# Altium schematic sheet Schema chargeur USB projet robot.SchDoc
size A4; PageSetup: Record=PageOptions|CenterHorizontal=True|CenterVertical=True|PrintScale=1.42|XCorrection=1.00|YCorrection=1.00|PrintKind=0|BorderSize=5000000|LeftOffset=0|BottomOffset=0|Orientation=2|PaperLength=1000|PaperWidth=1000|Scale=100|PaperSource=7|PrintQuality=-4|MediaType=1|DitherType=10|PaperKind=A3|PrintScaleMode=1
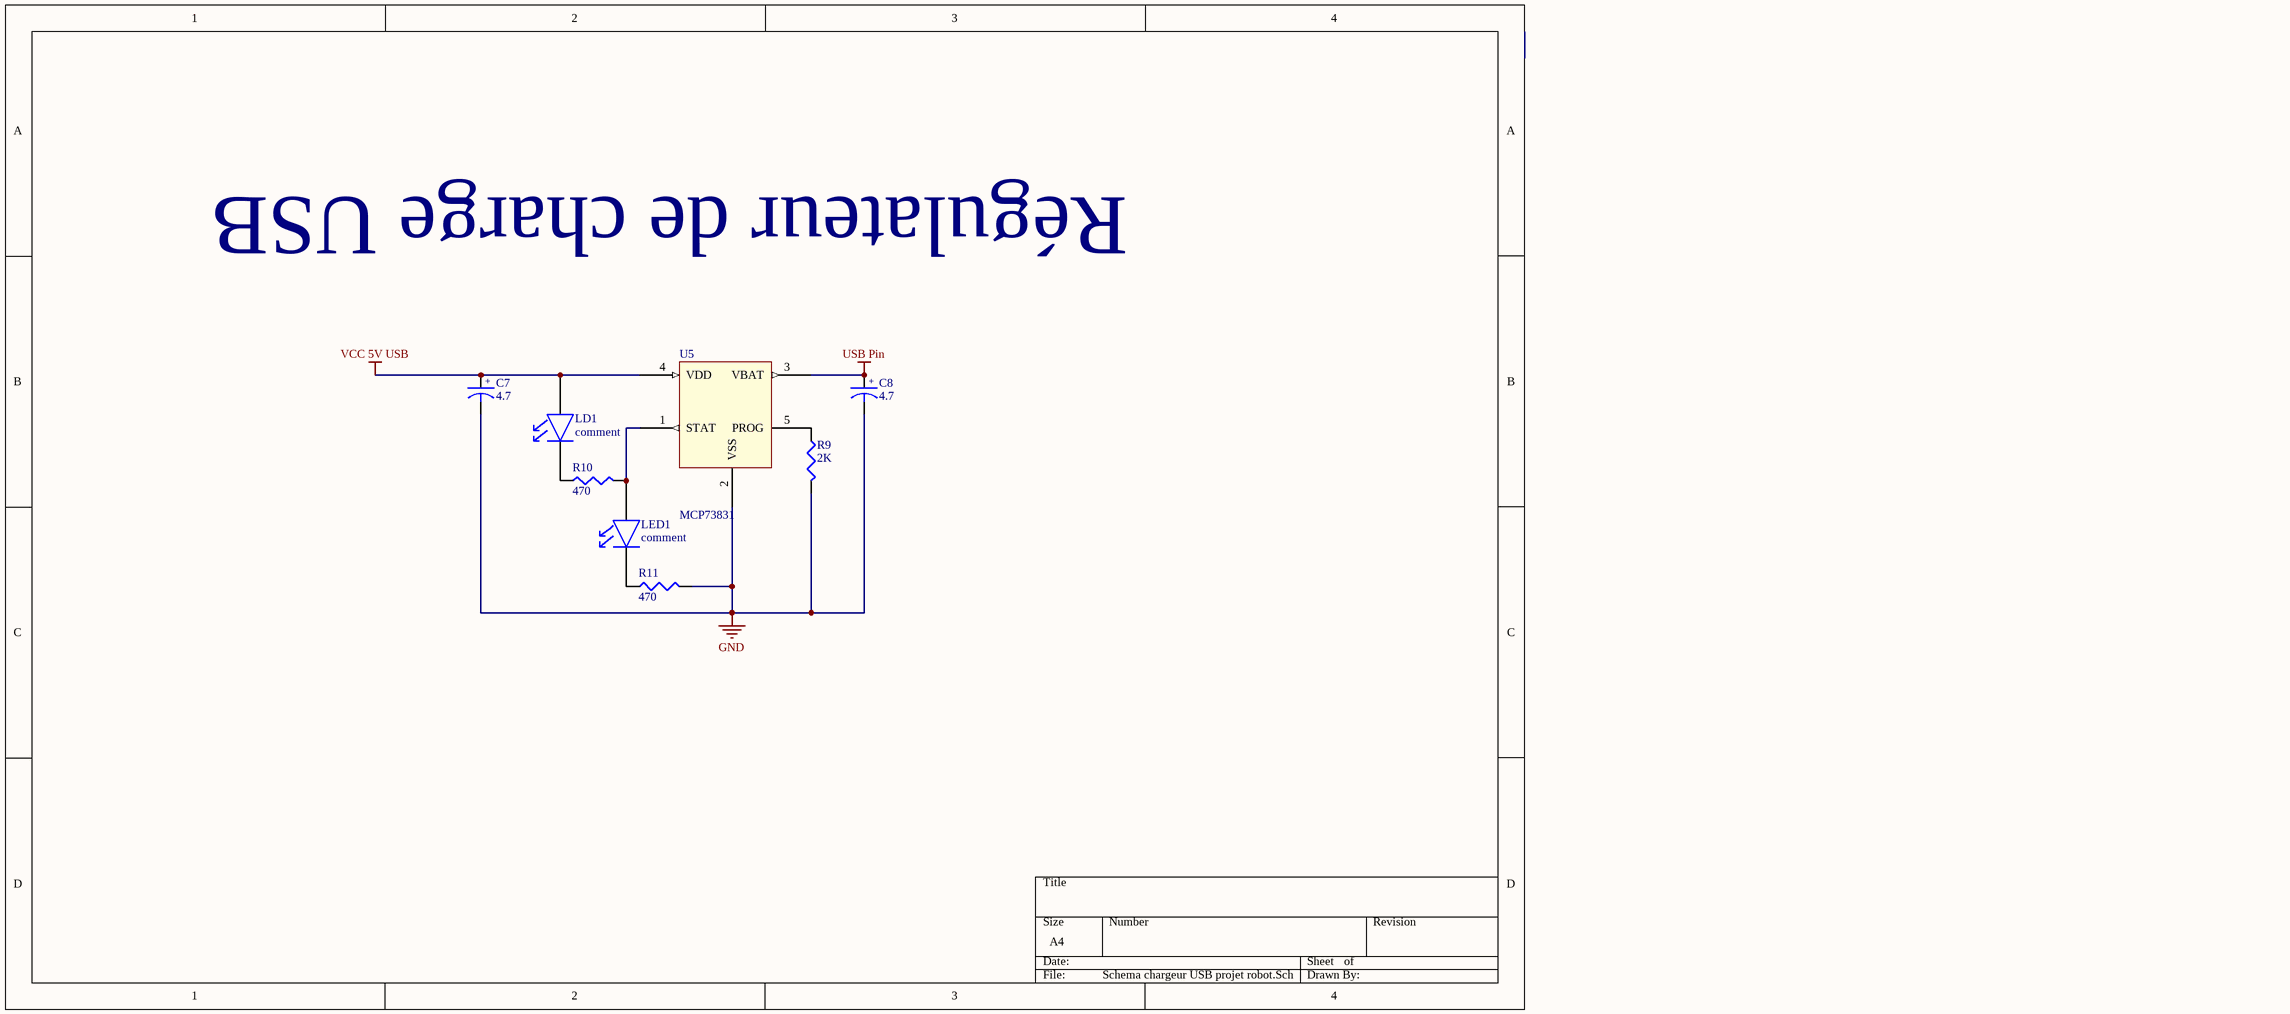
[diagram p0: Schema chargeur USB projet robot.SchDoc]

## Parts
C7  value 4.7  [293D/B]  (hidden comment: CAP_POL)
C8  value 4.7  [293D/B]  (hidden comment: CAP_POL)
LD1  comment  [LED0805]
LED1  comment  [LED0805]
R9  value 2K  [0805]  (hidden comment: RES)
R10  value 470  [0805]  (hidden comment: RES)
R11  value 470  [0805]  (hidden comment: RES)
U5  MCP73831  [MCP73831]

## Nets
GND: C7.2 C8.2 R9.2 R11.2 U5.2(VSS)
USB Pin: C8.1 U5.3(VBAT)
VCC 5V USB: C7.1 LD1.A U5.4(VDD)
NetLD1_K: LD1.K R10.1
NetLED1_A: LED1.A R10.2 U5.1(STAT)
NetLED1_K: LED1.K R11.1
NetR9_1: R9.1 U5.5(PROG)

## Notes on the sheet
- Régulateur de charge USB
- (in symbol CAP_POL) +

## Library data of the parts
C7 C8 = CAP_POL: capacité polarisée
LD1 LED1 = LED: LED 5mm/3mm/CMS
R9-R11 = RES: resistance
U5 = MCP73831: Voltage regulator for Li-po or li-ion battery, USB compatible